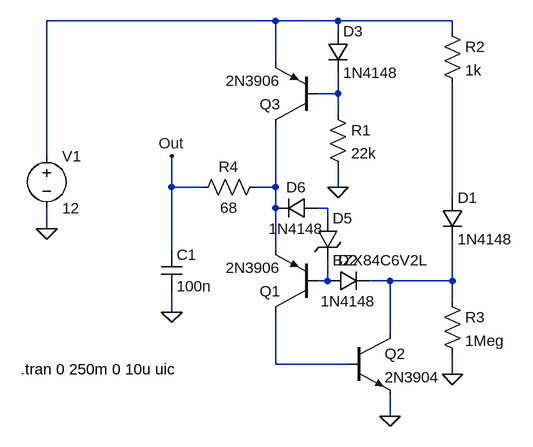
[diagram p0: schematic LinearRamp3-by alan.asc]
LinearRamp3-by alan.asc, the LTspice schematic file:
Version 4
SHEET 1 880 680
WIRE 128 -224 -224 -224
WIRE 224 -224 128 -224
WIRE 400 -224 224 -224
WIRE 224 -208 224 -224
WIRE 400 -208 400 -224
WIRE 128 -160 128 -224
WIRE 224 -112 224 -144
WIRE 224 -112 192 -112
WIRE 224 -80 224 -112
WIRE -224 -16 -224 -224
WIRE -32 32 -32 -16
WIRE 16 32 -32 32
WIRE 128 32 128 -64
WIRE 128 32 96 32
WIRE 224 32 224 0
WIRE 400 48 400 -128
WIRE 128 64 128 32
WIRE 208 64 192 64
WIRE 208 80 208 64
WIRE -224 96 -224 64
WIRE -32 128 -32 32
WIRE 128 128 128 64
WIRE 208 176 208 144
WIRE 208 176 192 176
WIRE 304 176 272 176
WIRE 400 176 400 112
WIRE 400 176 304 176
WIRE 400 208 400 176
WIRE -32 224 -32 192
WIRE 304 256 304 176
WIRE 128 304 128 224
WIRE 240 304 128 304
WIRE 400 320 400 288
WIRE 304 384 304 352
FLAG 304 384 0
FLAG -32 224 0
FLAG -224 96 0
FLAG 400 320 0
FLAG -32 -16 Out
FLAG 224 32 0
SYMBOL pnp 192 224 R180
SYMATTR InstName Q1
SYMATTR Value 2N3906
SYMBOL npn 240 256 R0
SYMATTR InstName Q2
SYMATTR Value 2N3904
SYMBOL cap -48 128 R0
SYMATTR InstName C1
SYMATTR Value 100n
SYMBOL voltage -224 -32 R0
WINDOW 123 0 0 Left 0
WINDOW 39 0 0 Left 0
SYMATTR InstName V1
SYMATTR Value 12
SYMBOL res 384 -224 R0
SYMATTR InstName R2
SYMATTR Value 1k
SYMBOL res 384 192 R0
SYMATTR InstName R3
SYMATTR Value 1Meg
SYMBOL diode 208 192 R270
WINDOW 0 32 32 VTop 0
WINDOW 3 0 32 VBottom 0
SYMATTR InstName D2
SYMATTR Value 1N4148
SYMBOL pnp 192 -64 R180
SYMATTR InstName Q3
SYMATTR Value 2N3906
SYMBOL diode 208 -208 R0
SYMATTR InstName D3
SYMATTR Value 1N4148
SYMBOL res 208 -96 R0
SYMATTR InstName R1
SYMATTR Value 22k
SYMBOL res 112 16 R90
WINDOW 0 0 56 VBottom 0
WINDOW 3 32 56 VTop 0
SYMATTR InstName R4
SYMATTR Value 68
SYMBOL diode 384 48 R0
SYMATTR InstName D1
SYMATTR Value 1N4148
SYMBOL zener 192 80 R0
SYMATTR InstName D5
SYMATTR Value BZX84C6V2L
SYMBOL diode 192 48 R90
WINDOW 0 0 32 VBottom 0
WINDOW 3 32 32 VTop 0
SYMATTR InstName D6
SYMATTR Value 1N4148
TEXT -264 312 Left 0 !.tran 0 250m 0 10u uic

The netlist it stands for:
* LinearRamp3-by alan.asc
Q1 N008 N006 N003 0 2N3906
Q2 N007 N008 0 0 2N3904
C1 Out 0 100n
V1 N001 0 12
R2 N001 N004 1k
R3 N007 0 1Meg
D2 N006 N007 1N4148
Q3 N003 N002 N001 0 2N3906
D3 N001 N002 1N4148
R1 N002 0 22k
R4 N003 Out 68
D1 N004 N007 1N4148
D5 N005 N006 BZX84C6V2L
D6 N005 N003 1N4148
.model D D
.lib standard.dio
.model NPN NPN
.model PNP PNP
.lib standard.bjt
.tran 0 250m 0 10u uic
.backanno
.end